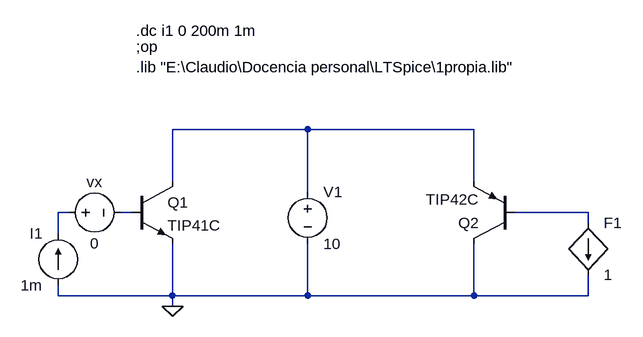
[diagram p0: schematic tip41_1.asc]
tip41_1.asc, the LTspice schematic file:
Version 4
SHEET 1 904 680
WIRE 416 32 208 32
WIRE 672 32 416 32
WIRE 208 112 208 32
WIRE 672 112 672 32
WIRE 416 128 416 32
WIRE 48 160 32 160
WIRE 144 160 128 160
WIRE 848 160 736 160
WIRE 848 176 848 160
WIRE 32 192 32 160
WIRE 32 288 32 272
WIRE 208 288 208 208
WIRE 208 288 32 288
WIRE 416 288 416 208
WIRE 416 288 208 288
WIRE 672 288 672 208
WIRE 672 288 416 288
WIRE 848 288 848 256
WIRE 848 288 672 288
WIRE 208 304 208 288
FLAG 208 304 0
SYMBOL npn 144 112 R0
SYMATTR InstName Q1
SYMATTR Value TIP41C
SYMBOL voltage 416 112 R0
WINDOW 123 0 0 Left 0
WINDOW 39 0 0 Left 0
SYMATTR InstName V1
SYMATTR Value 10
SYMBOL current 32 272 R180
WINDOW 0 24 80 Left 2
WINDOW 3 24 0 Left 2
WINDOW 123 0 0 Left 0
WINDOW 39 0 0 Left 0
SYMATTR InstName I1
SYMATTR Value 1m
SYMBOL pnp 736 208 R180
SYMATTR InstName Q2
SYMATTR Value TIP42C
SYMBOL f 848 176 R0
SYMATTR InstName F1
SYMATTR Value 1
SYMATTR SpiceModel vx
SYMBOL voltage 32 160 R270
WINDOW 0 32 56 VTop 2
WINDOW 3 -32 56 VBottom 2
WINDOW 123 0 0 Left 0
WINDOW 39 0 0 Left 0
SYMATTR InstName vx
SYMATTR Value 0
TEXT 152 -64 Left 2 !.lib "E:\\Claudio\\Docencia personal\\LTSpice\\1propia.lib"
TEXT 152 -96 Left 2 !;op
TEXT 152 -120 Left 2 !.dc i1 0 200m 1m

The netlist it stands for:
* tip41_1.asc
Q1 N001 N003 0 0 TIP41C
V1 N001 0 10
I1 0 N002 1m
Q2 0 N004 N001 0 TIP42C
F1 N004 0 vx 1
vx N002 N003 0
.model NPN NPN
.model PNP PNP
.lib standard.bjt
.lib "E:\Claudio\Docencia personal\LTSpice\1propia.lib"
;op
.dc i1 0 200m 1m
.backanno
.end